# EasyEDA schematic 桌面智能台灯.json
TITLE: Sheet_1; REV: 1.0; Date: 2022-05-24; Sheet: 1/1; Drawn By: bsp_led; Company: Your Company
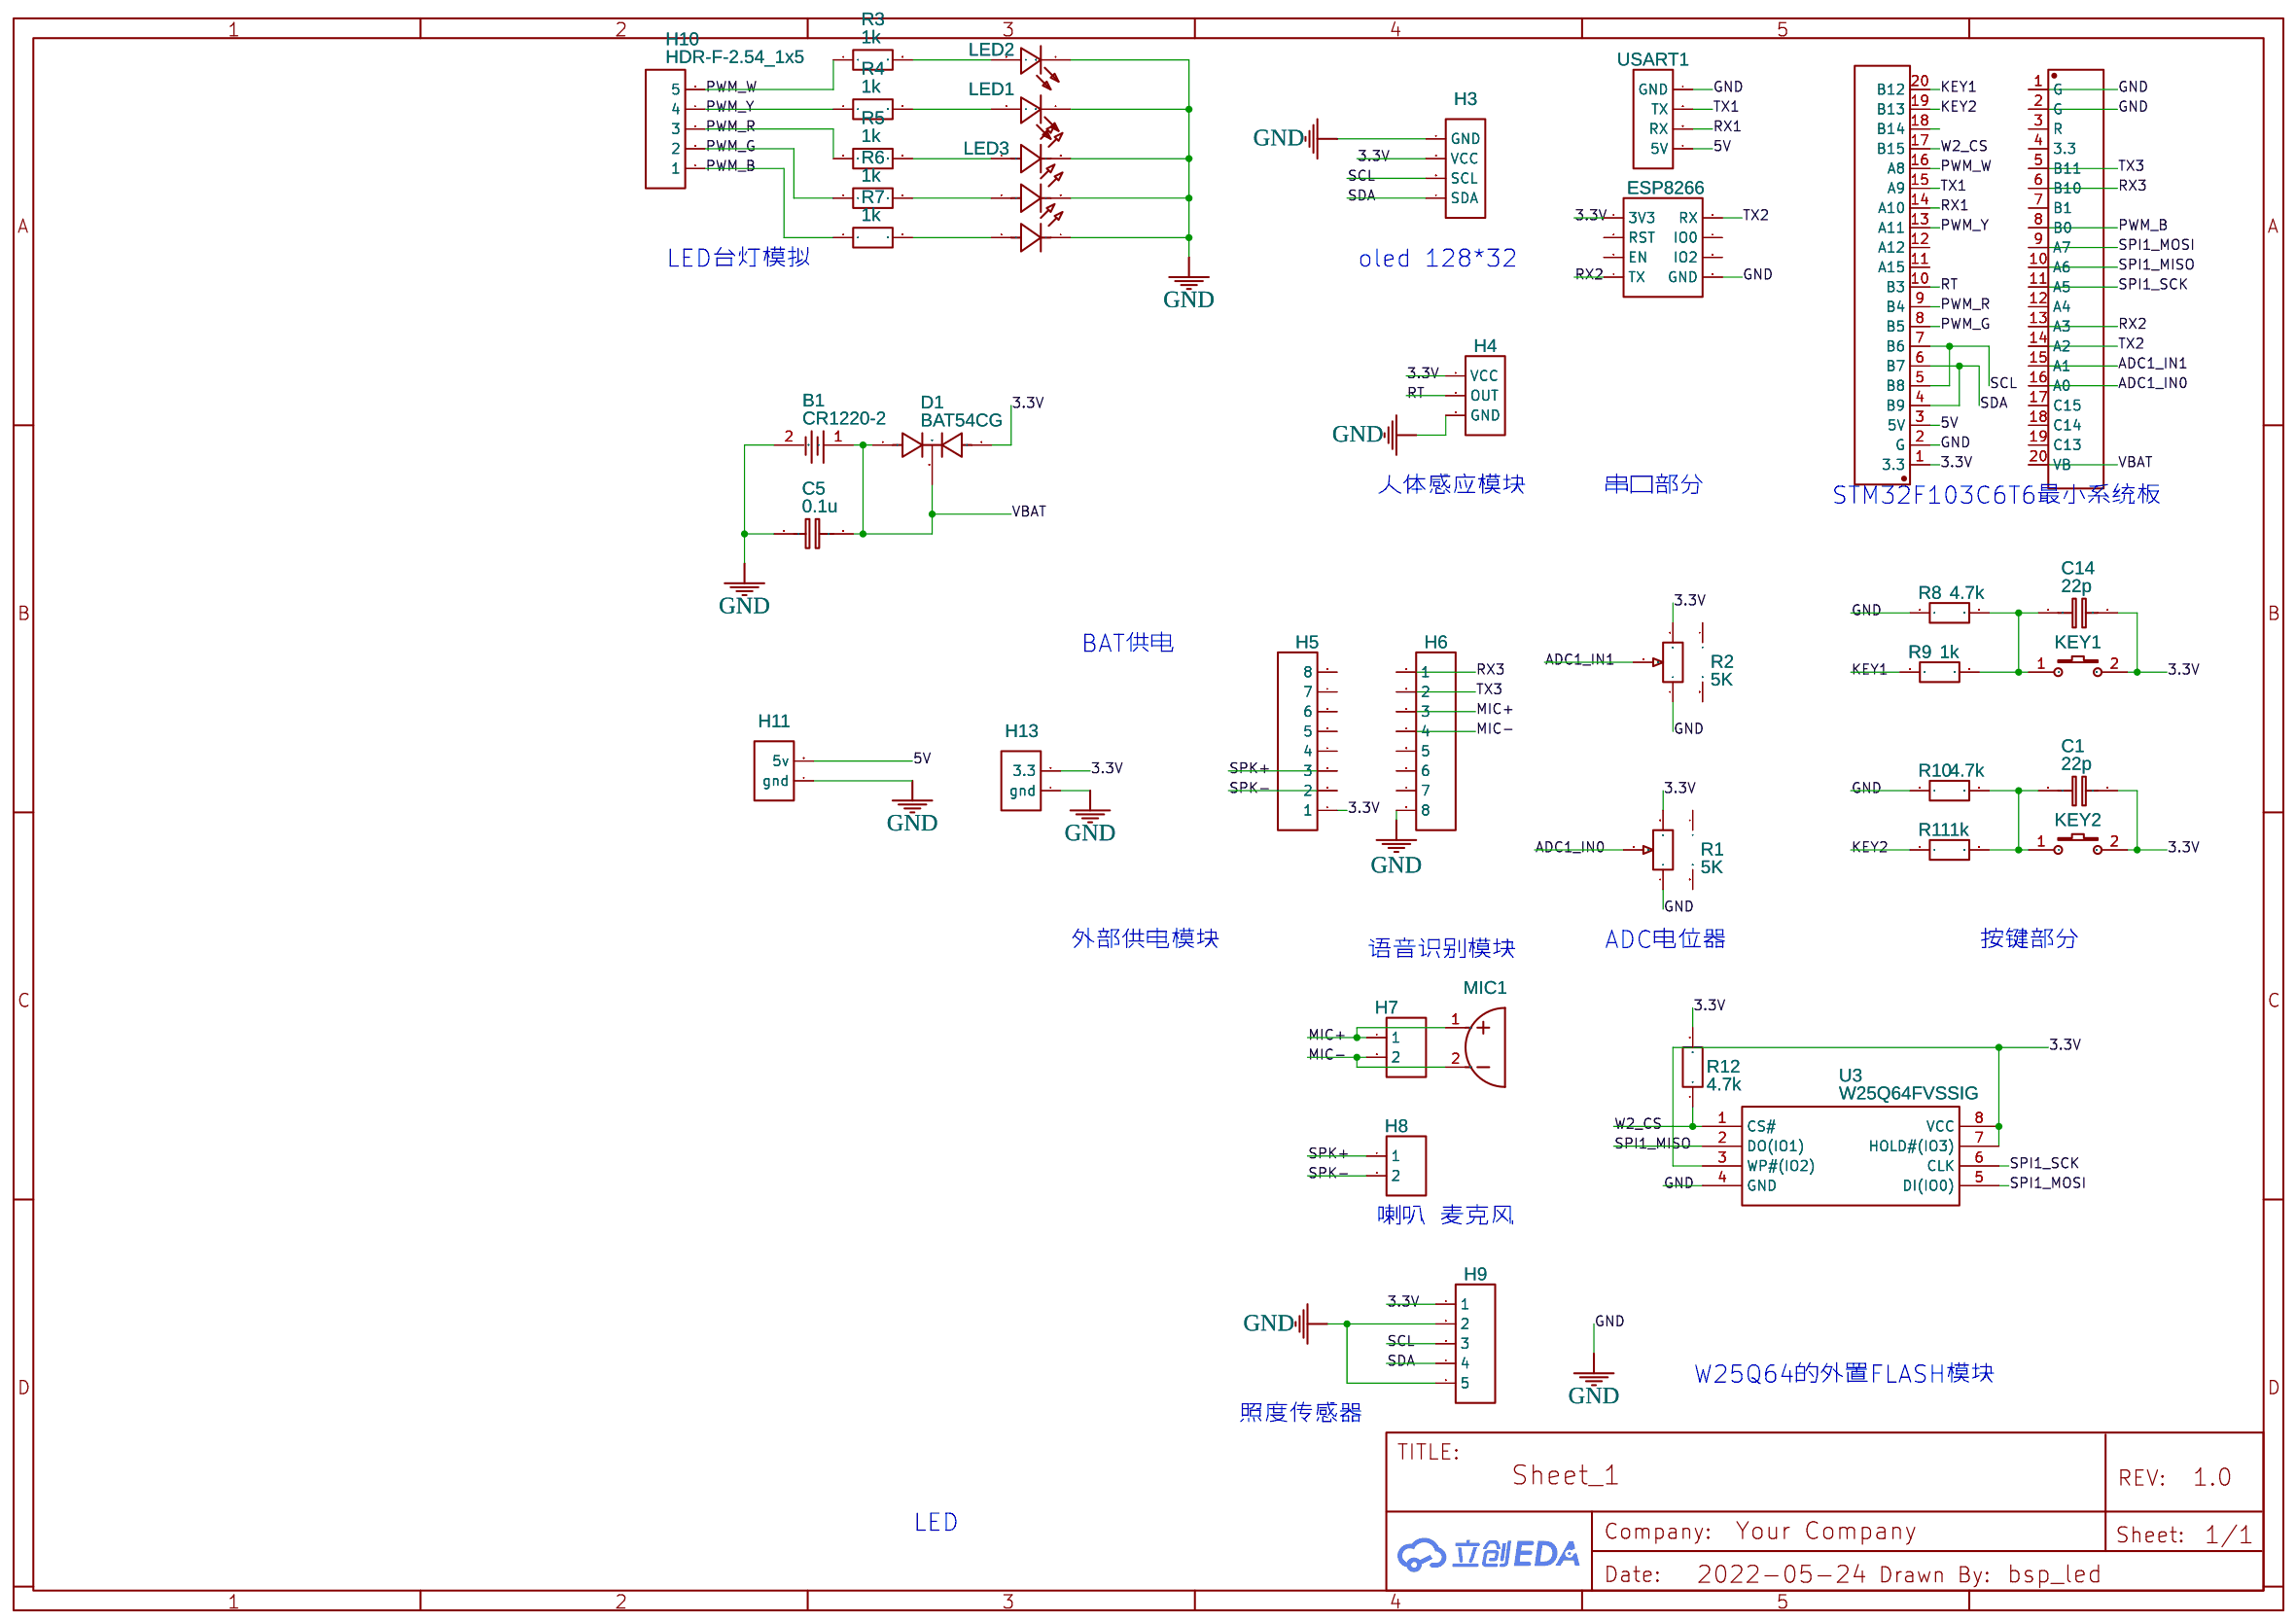
[diagram p0: schematic sheet]

## Parts
B1  CR1220-2  [BAT-SMD_CR1220-2]
C1  22p  [C1206]
C5  0.1u  [C1206]
C14  22p  [C1206]
D1  BAT54CG  [SOT-23-3_L2.9-W1.3-P1.90-LS2.4-BR]
ESP8266  HDR-F-2.54_2x4  [HDR-F-2.54_2X4]
H1  2  [HDR-TH_20P-P2.54-V-F]
H2  1  [HDR-TH_20P-P2.54-V-F]
H3  HDR-F-2.54_1x4  [HDR-F-2.54_1X4]
H4  HDR-F-2.54_1x3  [HDR-F-2.54_1X3]
H5  HDR-F-2.54_1x8  [HDR-F-2.54_1X8]
H6  HDR-F-2.54_1x8  [HDR-F-2.54_1X8]
H7  HDR-F-2.54_1x2  [HDR-F-2.54_1X2]
H8  HDR-F-2.54_1x2  [HDR-F-2.54_1X2]
H9  HDR-F-2.54_1x5  [HDR-F-2.54_1X5]
H10  HDR-F-2.54_1x5  [HDR-F-2.54_1X5]
H11  HDR-F-2.54_1x2  [HDR-F-2.54_1X2]
H13  HDR-F-2.54_1x2  [HDR-F-2.54_1X2]
KEY1  K2-3.6×6.1_SMD  [KEY-SMD_2P-L6.2-W3.6-LS8.0]
KEY2  K2-3.6×6.1_SMD  [KEY-SMD_2P-L6.2-W3.6-LS8.0]
LED1  2835正白光0.5W  [LED-SMD_L3.5-W2.8-FD-2835_WHITE]
LED2  2835正白光0.5W  [LED-SMD_L3.5-W2.8-FD-2835_WHITE]
LED3  TC5050RGBF08-3CJH-AF53A  [LED-SMD_6P-L5.0-W5.0-TR_TC5050RGBF08]
MIC1  GMI4015P-30DB  [MIC-TH_BD4.0-P1.4-D0.4-L-FD]
R1  5K  [RES-TH_WH160-1-104]
R2  5K  [RES-TH_WH160-1-104]
R3  1k  [R0805]
R4  1k  [R0805]
R5  1k  [R0805]
R6  1k  [R0805]
R7  1k  [R0805]
R8  4.7k  [R0805]
R9  1k  [R0805]
R10  4.7k  [R0805]
R11  1k  [R0805]
R12  4.7k  [R0805]
U3  W25Q64FVSSIG  [SOIC-8_L5.3-W5.3-P1.27-LS8.0-BL]
USART1  HDR-F-2.54_1x4  [HDR-F-2.54_1X4]

## Library data of the parts
B1 = CR1220-2: Supplier: LCSC; Manufacturer: Q&J; Supplier Part: C70381; JLCPCB Part Class: Extended Part
C1 C5 C14 = C_1206_EU: Contributor: LCEDA_Lib
D1 = BAT54CG: Supplier: LCSC; Supplier Part: C393559; Manufacturer: Galaxy; Contributor: LCSC; JLCPCB Part Class: Extended Part
ESP8266 = HDR-F-2.54_2x4: Supplier Part: C239344; Supplier: LCSC; Contributor: LCEDA_Lib
H1 H2 = 220S-1*20P H=8.5MM Ytype Gold-plated: Supplier: LCSC; Manufacturer: Ckmtw; Contributor: LCSC; Supplier Part: C124410; JLCPCB SMD: Yes; SMT Type: Extend
H3 USART1 = HDR-F-2.54_1x4: Supplier Part: C225501; Supplier: LCSC; Contributor: LCEDA_Lib
H4 = HDR-F-2.54_1x3: Supplier Part: C146690; Supplier: LCSC; Contributor: LCEDA_Lib
H5 H6 = HDR-F-2.54_1x8: Supplier Part: C225505; Supplier: LCSC; Contributor: LCEDA_Lib
H7 H8 H11 H13 = HDR-F-2.54_1x2: Supplier Part: C49661; Supplier: LCSC; Contributor: LCEDA_Lib
H9 H10 = HDR-F-2.54_1x5: Supplier Part: C50950; Supplier: LCSC; Contributor: LCEDA_Lib
KEY1 KEY2 = K2-3.6×6.1_SMD: Supplier Part: C118141; Supplier: LCSC; Manufacturer Part: K2-1107ST-A4SW-06; Contributor: LCEDA_Lib; 制造商: 韩国韩荣
LED1 LED2 = 2835正白光0.5W: Supplier: LCSC; Supplier Part: C2895090; JLCPCB Part Class: Extended Part; Contributor: LCSC
LED3 = TC5050RGBF08-3CJH-AF53A: Supplier: LCSC; Supplier Part: C784540; Manufacturer: TCWIN; Contributor: LCSC; JLCPCB Part Class: Extended Part
MIC1 = GMI4015P-30DB: Supplier: LCSC; Supplier Part: C529894; Manufacturer: INGHAi; Contributor: LCSC; JLCPCB Part Class: Extended Part
R1 R2 = Potentiometer WH160-1-104: Supplier: LCSC; Manufacturer: JML; Supplier Part: C61836
R3-R12 = R_0805_EU: Contributor: LCEDA_Lib
U3 = W25Q64FVSSIG: Supplier: LCSC; Manufacturer: WINBOND; Supplier Part: C14067

## Nets
3.3V: C1.1 C14.1 D1.2(A) ESP8266.1(3V3) H2.1(3.3) H3.2(VCC) H4.1(VCC) H5.1 H9.1 H13.2(3.3) KEY1.2 KEY2.2 R1.3 R2.3 R12.2 U3.3(WP#(IO2)) U3.7(HOLD#(IO3)) U3.8(VCC)
5V: H2.3(5V) H11.2(5v) USART1.1(5V)
GND: B1.2 C5.1 ESP8266.8(GND) H1.1(G) H1.2(G) H2.2(G) H3.1(GND) H4.3(GND) H6.8 H9.2 H9.5 H11.1(gnd) H13.1(gnd) LED1.1(C) LED2.1(C) LED3.4(-) LED3.5(-) LED3.6(-) R1.1 R2.1 R8.1 R10.1 U3.4(GND) USART1.4(GND)
VBAT: B1.1 C5.2 D1.1(A) D1.3(C) H1.20(VB)
ADC1_IN0: H1.16(A0) R1.2
ADC1_IN1: H1.15(A1) R2.2
KEY1: H2.20(B12) R9.1
KEY2: H2.19(B13) R11.1
MIC+: H6.3 H7.1 MIC1.1
MIC-: H6.4 H7.2 MIC1.2
PWM_B: H1.8(B0) H10.1 R7.1
PWM_G: H2.8(B5) H10.2 R6.1
PWM_R: H2.9(B4) H10.3 R5.1
PWM_W: H2.16(A8) H10.5 R3.1
PWM_Y: H2.13(A11) H10.4 R4.1
RT: H2.10(B3) H4.2(OUT)
RX1: H2.14(A10) USART1.2(RX)
RX2: ESP8266.7(TX) H1.13(A3)
RX3: H1.6(B10) H6.1
SCL: H2.5(B8) H2.7(B6) H3.3(SCL) H9.3
SDA: H2.4(B9) H2.6(B7) H3.4(SDA) H9.4
SPI1_MISO: H1.10(A6) U3.2(DO(IO1))
SPI1_MOSI: H1.9(A7) U3.5(DI(IO0))
SPI1_SCK: H1.11(A5) U3.6(CLK)
SPK+: H5.3 H8.1
SPK-: H5.2 H8.2
TX1: H2.15(A9) USART1.3(TX)
TX2: ESP8266.2(RX) H1.14(A2)
TX3: H1.5(B11) H6.2
W2_CS: H2.17(B15) R12.1 U3.1(CS#)
Net-(C1-2): C1.2 KEY2.1 R10.2 R11.2
Net-(C14-2): C14.2 KEY1.1 R8.2 R9.2
Net-(LED1-2): LED1.2(A) R4.2
Net-(LED2-2): LED2.2(A) R3.2
Net-(LED3-1): LED3.1(+) R5.2
Net-(LED3-2): LED3.2(+) R6.2
Net-(LED3-3): LED3.3(+) R7.2

Not connected (* = marked no-connect by the designer): ESP8266 3(RST) 4(IO0) 5(EN) 6(IO2); H1 3(R) 4(3.3) 7(B1) 12(A4) 17(C15) 18(C14) 19(C13); H2 11(A15) 12(A12) 18(B14); H5 4 5 6 7 8; H6 5 6 7; R1 4 5; R2 4 5

## Notes on the sheet
- LED台灯模拟
- oled 128*32
- 人体感应模块
- 串口部分
- STM32F103C6T6最小系统板
- BAT供电
- 外部供电模块
- 语音识别模块
- ADC电位器
- 按键部分
- 喇叭 麦克风
- W25Q64的外置FLASH模块
- 照度传感器
- LED
